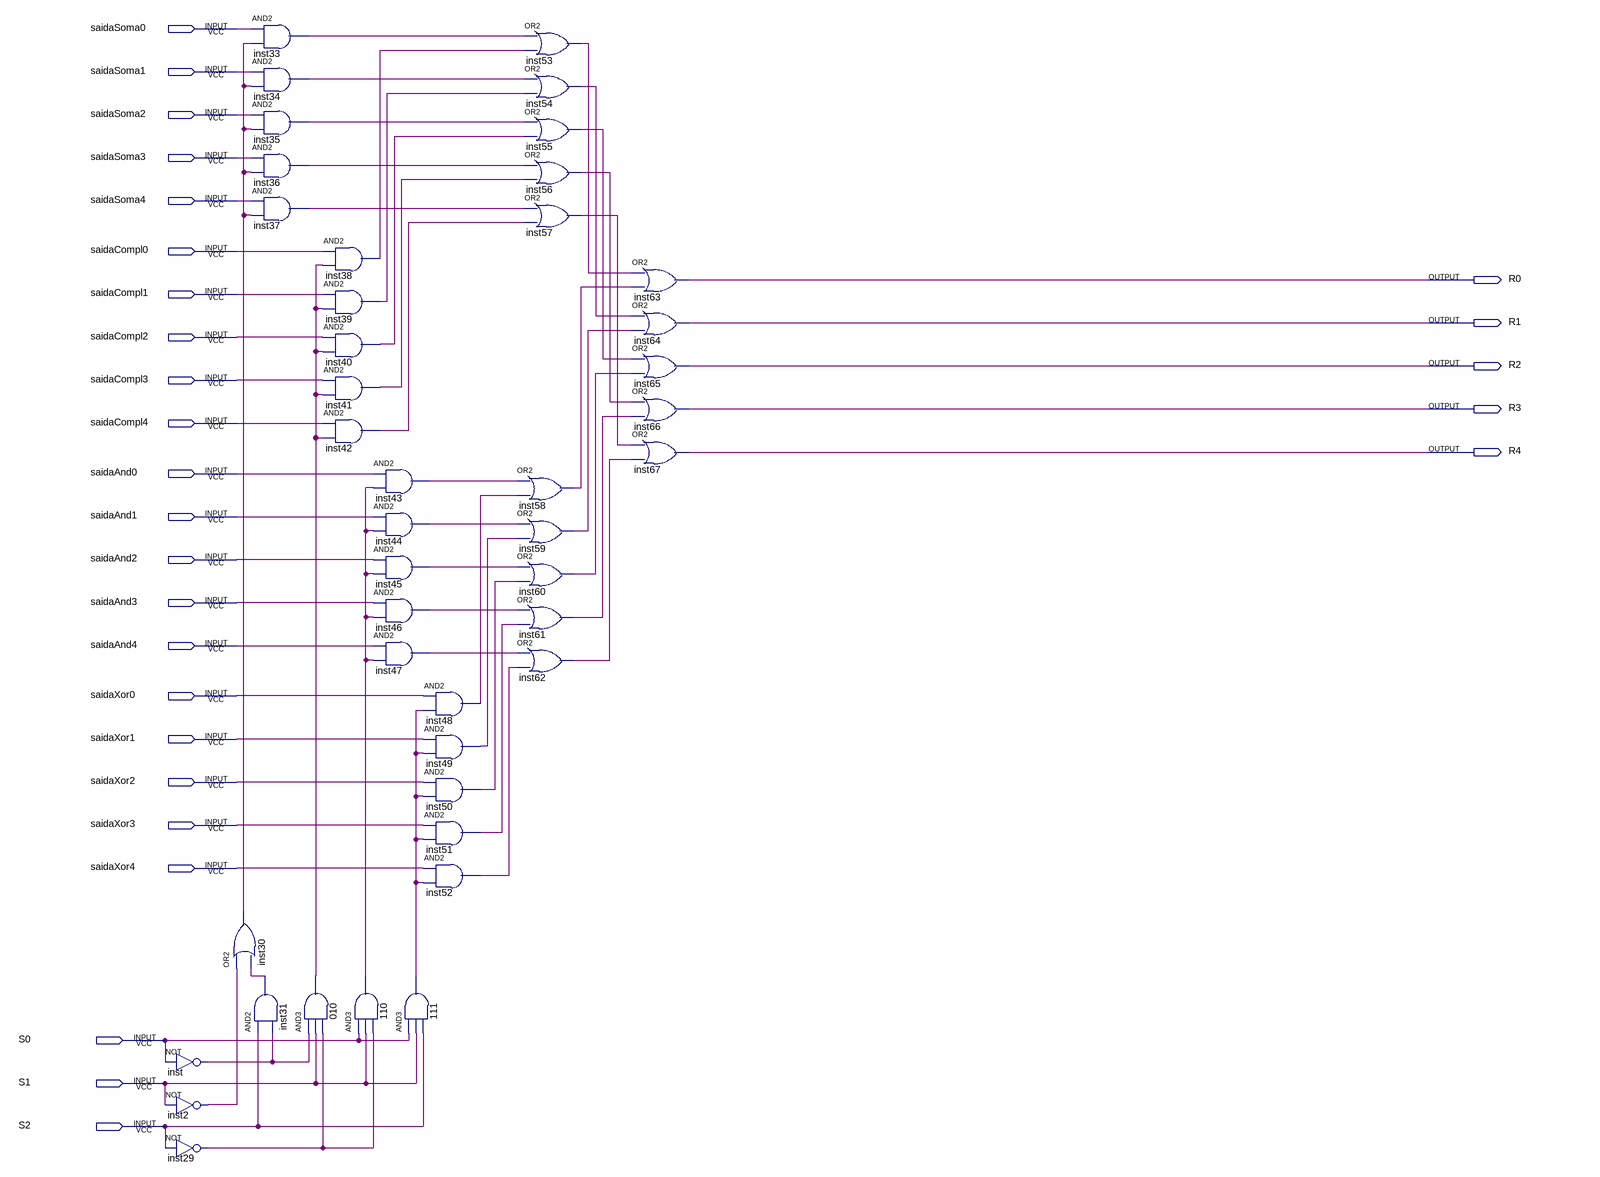
[diagram p0: schematic sheet]
// Quartus schematic sdProject_Mux.bdf as structural Verilog: 43 symbols, 28 pins
module sdProject_Mux (
  input  saidaSoma0,
  input  saidaSoma1,
  input  saidaSoma2,
  input  saidaSoma3,
  input  saidaSoma4,
  input  saidaCompl0,
  input  saidaCompl1,
  input  saidaCompl2,
  input  saidaCompl3,
  input  saidaCompl4,
  input  saidaAnd0,
  input  saidaAnd1,
  input  saidaAnd2,
  input  saidaAnd3,
  input  saidaAnd4,
  input  saidaXor0,
  input  saidaXor1,
  input  saidaXor2,
  input  saidaXor3,
  input  saidaXor4,
  input  S0,
  input  S1,
  input  S2,
  output R0,
  output R1,
  output R2,
  output R3,
  output R4
);

  wire inst2_out, inst29_out, inst30_out, inst31_out, inst33_out, inst34_out, inst35_out, inst36_out,
       inst37_out, inst38_out, inst39_out, inst40_out, inst41_out, inst42_out, inst43_out, inst44_out,
       inst45_out, inst46_out, inst47_out, inst48_out, inst49_out, inst50_out, inst51_out, inst52_out,
       inst53_out, inst54_out, inst55_out, inst56_out, inst57_out, inst58_out, inst59_out, inst60_out,
       inst61_out, inst62_out, inst_out, n010_out, n110_out, n111_out;

  not inst (inst_out, S0);
  not inst2 (inst2_out, S1);
  not inst29 (inst29_out, S2);
  or inst30 (inst30_out, inst2_out, inst31_out);
  and inst33 (inst33_out, saidaSoma0, inst30_out);
  and inst34 (inst34_out, saidaSoma1, inst30_out);
  and inst35 (inst35_out, saidaSoma2, inst30_out);
  and inst36 (inst36_out, saidaSoma3, inst30_out);
  and inst37 (inst37_out, saidaSoma4, inst30_out);
  and inst31 (inst31_out, S2, inst_out);
  and inst38 (inst38_out, saidaCompl0, n010_out);
  and inst39 (inst39_out, saidaCompl1, n010_out);
  and inst40 (inst40_out, saidaCompl2, n010_out);
  and inst41 (inst41_out, saidaCompl3, n010_out);
  and inst42 (inst42_out, saidaCompl4, n010_out);
  and u_110 (n110_out, S0, S1, inst29_out);
  and u_010 (n010_out, inst_out, S1, inst29_out);
  and inst43 (inst43_out, saidaAnd0, n110_out);
  and inst44 (inst44_out, saidaAnd1, n110_out);
  and inst45 (inst45_out, saidaAnd2, n110_out);
  and inst46 (inst46_out, saidaAnd3, n110_out);
  and inst47 (inst47_out, saidaAnd4, n110_out);
  and u_111 (n111_out, S0, S1, S2);
  and inst48 (inst48_out, saidaXor0, n111_out);
  and inst49 (inst49_out, saidaXor1, n111_out);
  and inst50 (inst50_out, saidaXor2, n111_out);
  and inst51 (inst51_out, saidaXor3, n111_out);
  and inst52 (inst52_out, saidaXor4, n111_out);
  or inst58 (inst58_out, inst43_out, inst48_out);
  or inst59 (inst59_out, inst44_out, inst49_out);
  or inst60 (inst60_out, inst45_out, inst50_out);
  or inst61 (inst61_out, inst46_out, inst51_out);
  or inst62 (inst62_out, inst47_out, inst52_out);
  or inst53 (inst53_out, inst33_out, inst38_out);
  or inst54 (inst54_out, inst34_out, inst39_out);
  or inst55 (inst55_out, inst35_out, inst40_out);
  or inst56 (inst56_out, inst36_out, inst41_out);
  or inst57 (inst57_out, inst37_out, inst42_out);
  or inst63 (R0, inst53_out, inst58_out);
  or inst64 (R1, inst54_out, inst59_out);
  or inst65 (R2, inst55_out, inst60_out);
  or inst66 (R3, inst56_out, inst61_out);
  or inst67 (R4, inst57_out, inst62_out);
endmodule
